# Altium schematic sheet LED.SchDoc
size A1
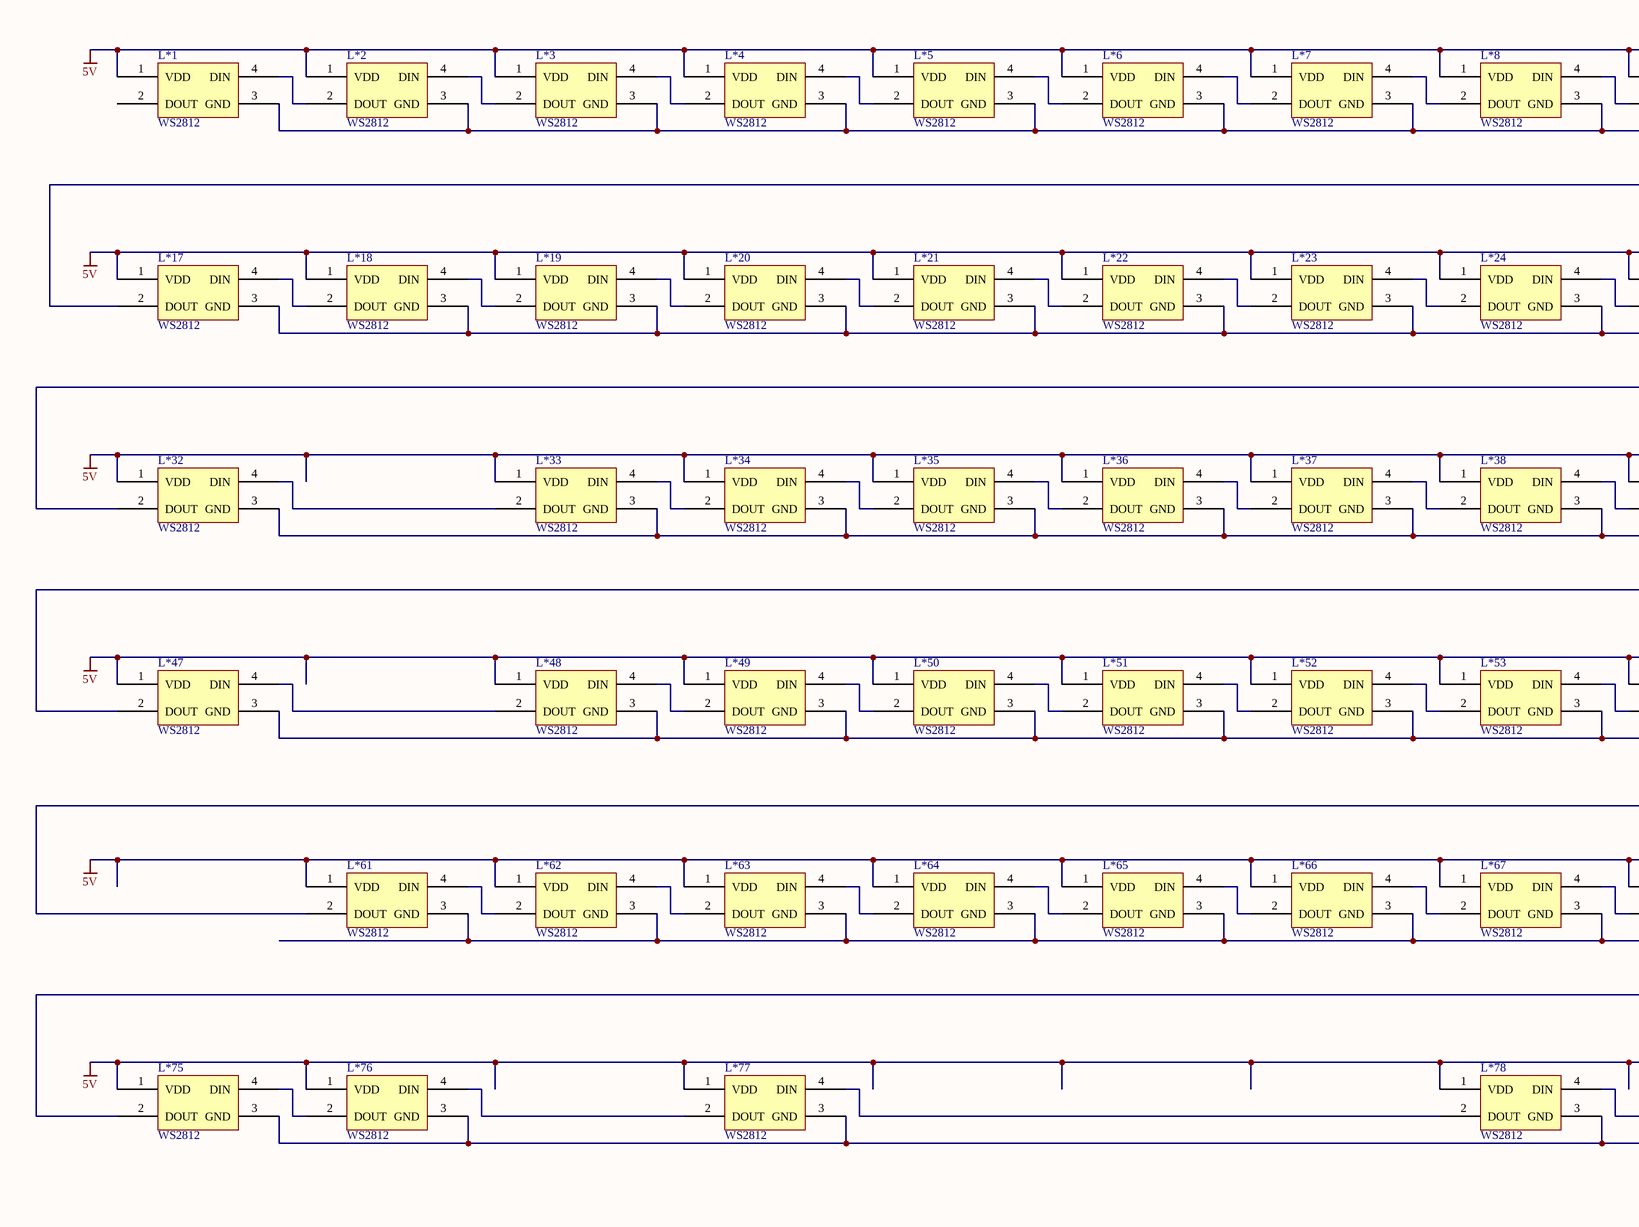
[diagram p0: LED.SchDoc, left]
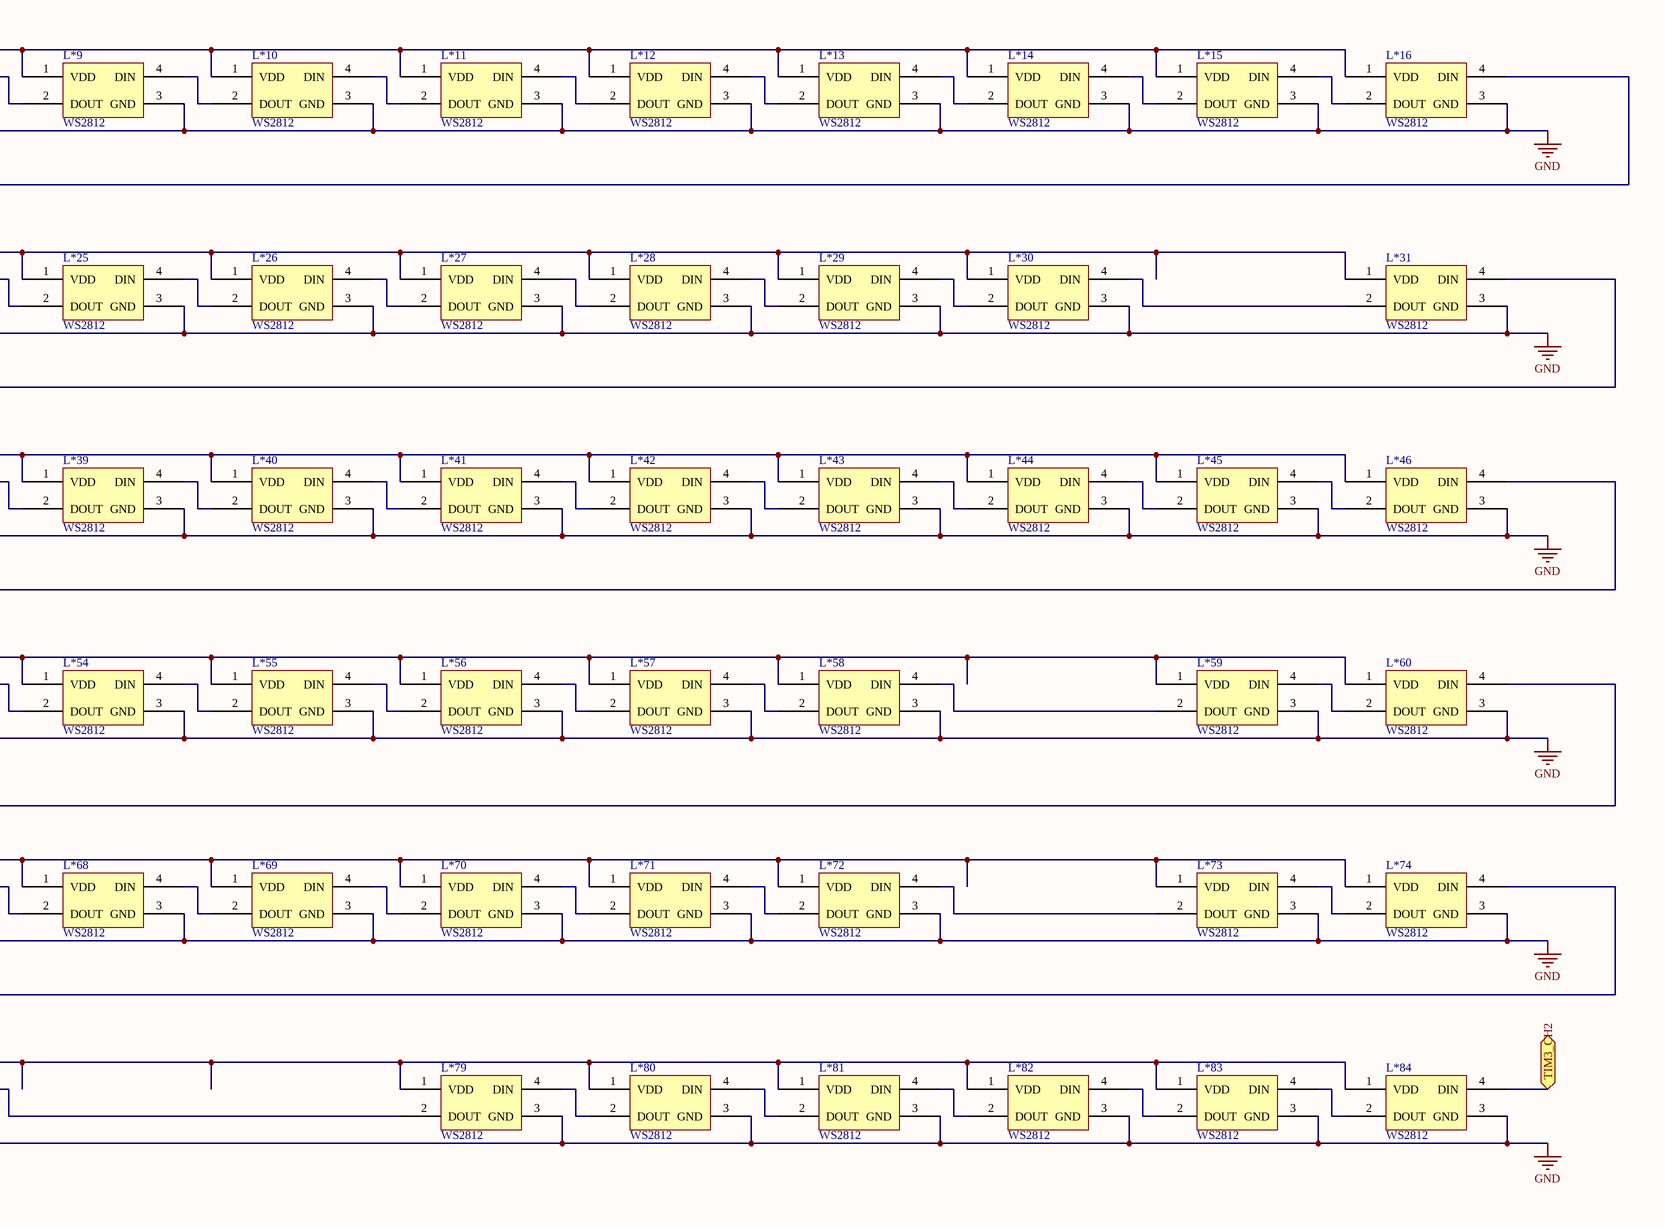
[diagram p1: LED.SchDoc, right]

## Parts
L*1  WS2812  [3528-4反贴]
L*2  WS2812  [3528-4反贴]
L*3  WS2812  [3528-4反贴]
L*4  WS2812  [3528-4反贴]
L*5  WS2812  [3528-4反贴]
L*6  WS2812  [3528-4反贴]
L*7  WS2812  [3528-4反贴]
L*8  WS2812  [3528-4反贴]
L*9  WS2812  [3528-4反贴]
L*10  WS2812  [3528-4反贴]
L*11  WS2812  [3528-4反贴]
L*12  WS2812  [3528-4反贴]
L*13  WS2812  [3528-4反贴]
L*14  WS2812  [3528-4反贴]
L*15  WS2812  [3528-4反贴]
L*16  WS2812  [3528-4反贴]
L*17  WS2812  [3528-4反贴]
L*18  WS2812  [3528-4反贴]
L*19  WS2812  [3528-4反贴]
L*20  WS2812  [3528-4反贴]
L*21  WS2812  [3528-4反贴]
L*22  WS2812  [3528-4反贴]
L*23  WS2812  [3528-4反贴]
L*24  WS2812  [3528-4反贴]
L*25  WS2812  [3528-4反贴]
L*26  WS2812  [3528-4反贴]
L*27  WS2812  [3528-4反贴]
L*28  WS2812  [3528-4反贴]
L*29  WS2812  [3528-4反贴]
L*30  WS2812  [3528-4反贴]
L*31  WS2812  [3528-4反贴]
L*32  WS2812  [3528-4反贴]
L*33  WS2812  [3528-4反贴]
L*34  WS2812  [3528-4反贴]
L*35  WS2812  [3528-4反贴]
L*36  WS2812  [3528-4反贴]
L*37  WS2812  [3528-4反贴]
L*38  WS2812  [3528-4反贴]
L*39  WS2812  [3528-4反贴]
L*40  WS2812  [3528-4反贴]
L*41  WS2812  [3528-4反贴]
L*42  WS2812  [3528-4反贴]
L*43  WS2812  [3528-4反贴]
L*44  WS2812  [3528-4反贴]
L*45  WS2812  [3528-4反贴]
L*46  WS2812  [3528-4反贴]
L*47  WS2812  [3528-4反贴]
L*48  WS2812  [3528-4反贴]
L*49  WS2812  [3528-4反贴]
L*50  WS2812  [3528-4反贴]
L*51  WS2812  [3528-4反贴]
L*52  WS2812  [3528-4反贴]
L*53  WS2812  [3528-4反贴]
L*54  WS2812  [3528-4反贴]
L*55  WS2812  [3528-4反贴]
L*56  WS2812  [3528-4反贴]
L*57  WS2812  [3528-4反贴]
L*58  WS2812  [3528-4反贴]
L*59  WS2812  [3528-4反贴]
L*60  WS2812  [3528-4反贴]
L*61  WS2812  [3528-4反贴]
L*62  WS2812  [3528-4反贴]
L*63  WS2812  [3528-4反贴]
L*64  WS2812  [3528-4反贴]
L*65  WS2812  [3528-4反贴]
L*66  WS2812  [3528-4反贴]
L*67  WS2812  [3528-4反贴]
L*68  WS2812  [3528-4反贴]
L*69  WS2812  [3528-4反贴]
L*70  WS2812  [3528-4反贴]
L*71  WS2812  [3528-4反贴]
L*72  WS2812  [3528-4反贴]
L*73  WS2812  [3528-4反贴]
L*74  WS2812  [3528-4反贴]
L*75  WS2812  [3528-4反贴]
L*76  WS2812  [3528-4反贴]
L*77  WS2812  [3528-4反贴]
L*78  WS2812  [3528-4反贴]
L*79  WS2812  [3528-4反贴]
L*80  WS2812  [3528-4反贴]
L*81  WS2812  [3528-4反贴]
L*82  WS2812  [3528-4反贴]
L*83  WS2812  [3528-4反贴]
L*84  WS2812  [3528-4反贴]

## Ports
TIM3_CH2 (bidir)

## Nets
5V: L*1.1(VDD) L*2.1(VDD) L*3.1(VDD) L*4.1(VDD) L*5.1(VDD) L*6.1(VDD) L*7.1(VDD) L*8.1(VDD) L*9.1(VDD) L*10.1(VDD) L*11.1(VDD) L*12.1(VDD) L*13.1(VDD) L*14.1(VDD) L*15.1(VDD) L*16.1(VDD) L*17.1(VDD) L*18.1(VDD) L*19.1(VDD) L*20.1(VDD) L*21.1(VDD) L*22.1(VDD) L*23.1(VDD) L*24.1(VDD) L*25.1(VDD) L*26.1(VDD) L*27.1(VDD) L*28.1(VDD) L*29.1(VDD) L*30.1(VDD) L*31.1(VDD) L*32.1(VDD) L*33.1(VDD) L*34.1(VDD) L*35.1(VDD) L*36.1(VDD) L*37.1(VDD) L*38.1(VDD) L*39.1(VDD) L*40.1(VDD) L*41.1(VDD) L*42.1(VDD) L*43.1(VDD) L*44.1(VDD) L*45.1(VDD) L*46.1(VDD) L*47.1(VDD) L*48.1(VDD) L*49.1(VDD) L*50.1(VDD) L*51.1(VDD) L*52.1(VDD) L*53.1(VDD) L*54.1(VDD) L*55.1(VDD) L*56.1(VDD) L*57.1(VDD) L*58.1(VDD) L*59.1(VDD) L*60.1(VDD) L*61.1(VDD) L*62.1(VDD) L*63.1(VDD) L*64.1(VDD) L*65.1(VDD) L*66.1(VDD) L*67.1(VDD) L*68.1(VDD) L*69.1(VDD) L*70.1(VDD) L*71.1(VDD) L*72.1(VDD) L*73.1(VDD) L*74.1(VDD) L*75.1(VDD) L*76.1(VDD) L*77.1(VDD) L*78.1(VDD) L*79.1(VDD) L*80.1(VDD) L*81.1(VDD) L*82.1(VDD) L*83.1(VDD) L*84.1(VDD)
GND: L*1.3(GND) L*2.3(GND) L*3.3(GND) L*4.3(GND) L*5.3(GND) L*6.3(GND) L*7.3(GND) L*8.3(GND) L*9.3(GND) L*10.3(GND) L*11.3(GND) L*12.3(GND) L*13.3(GND) L*14.3(GND) L*15.3(GND) L*16.3(GND) L*17.3(GND) L*18.3(GND) L*19.3(GND) L*20.3(GND) L*21.3(GND) L*22.3(GND) L*23.3(GND) L*24.3(GND) L*25.3(GND) L*26.3(GND) L*27.3(GND) L*28.3(GND) L*29.3(GND) L*30.3(GND) L*31.3(GND) L*32.3(GND) L*33.3(GND) L*34.3(GND) L*35.3(GND) L*36.3(GND) L*37.3(GND) L*38.3(GND) L*39.3(GND) L*40.3(GND) L*41.3(GND) L*42.3(GND) L*43.3(GND) L*44.3(GND) L*45.3(GND) L*46.3(GND) L*47.3(GND) L*48.3(GND) L*49.3(GND) L*50.3(GND) L*51.3(GND) L*52.3(GND) L*53.3(GND) L*54.3(GND) L*55.3(GND) L*56.3(GND) L*57.3(GND) L*58.3(GND) L*59.3(GND) L*60.3(GND) L*61.3(GND) L*62.3(GND) L*63.3(GND) L*64.3(GND) L*65.3(GND) L*66.3(GND) L*67.3(GND) L*68.3(GND) L*69.3(GND) L*70.3(GND) L*71.3(GND) L*72.3(GND) L*73.3(GND) L*74.3(GND) L*75.3(GND) L*76.3(GND) L*77.3(GND) L*78.3(GND) L*79.3(GND) L*80.3(GND) L*81.3(GND) L*82.3(GND) L*83.3(GND) L*84.3(GND)
TIM3_CH2: L*84.4(DIN) ; port TIM3_CH2
NetL*1_4: L*1.4(DIN) L*2.2(DOUT)
NetL*2_4: L*2.4(DIN) L*3.2(DOUT)
NetL*3_4: L*3.4(DIN) L*4.2(DOUT)
NetL*4_4: L*4.4(DIN) L*5.2(DOUT)
NetL*5_4: L*5.4(DIN) L*6.2(DOUT)
NetL*6_4: L*6.4(DIN) L*7.2(DOUT)
NetL*7_4: L*7.4(DIN) L*8.2(DOUT)
NetL*8_4: L*8.4(DIN) L*9.2(DOUT)
NetL*9_4: L*9.4(DIN) L*10.2(DOUT)
NetL*10_4: L*10.4(DIN) L*11.2(DOUT)
NetL*11_4: L*11.4(DIN) L*12.2(DOUT)
NetL*12_4: L*12.4(DIN) L*13.2(DOUT)
NetL*13_4: L*13.4(DIN) L*14.2(DOUT)
NetL*14_4: L*14.4(DIN) L*15.2(DOUT)
NetL*15_4: L*15.4(DIN) L*16.2(DOUT)
NetL*16_4: L*16.4(DIN) L*17.2(DOUT)
NetL*17_4: L*17.4(DIN) L*18.2(DOUT)
NetL*18_4: L*18.4(DIN) L*19.2(DOUT)
NetL*19_4: L*19.4(DIN) L*20.2(DOUT)
NetL*20_4: L*20.4(DIN) L*21.2(DOUT)
NetL*21_4: L*21.4(DIN) L*22.2(DOUT)
NetL*22_4: L*22.4(DIN) L*23.2(DOUT)
NetL*23_4: L*23.4(DIN) L*24.2(DOUT)
NetL*24_4: L*24.4(DIN) L*25.2(DOUT)
NetL*25_4: L*25.4(DIN) L*26.2(DOUT)
NetL*26_4: L*26.4(DIN) L*27.2(DOUT)
NetL*27_4: L*27.4(DIN) L*28.2(DOUT)
NetL*28_4: L*28.4(DIN) L*29.2(DOUT)
NetL*29_4: L*29.4(DIN) L*30.2(DOUT)
NetL*30_4: L*30.4(DIN) L*31.2(DOUT)
NetL*31_4: L*31.4(DIN) L*32.2(DOUT)
NetL*32_4: L*32.4(DIN) L*33.2(DOUT)
NetL*33_4: L*33.4(DIN) L*34.2(DOUT)
NetL*34_4: L*34.4(DIN) L*35.2(DOUT)
NetL*35_4: L*35.4(DIN) L*36.2(DOUT)
NetL*36_4: L*36.4(DIN) L*37.2(DOUT)
NetL*37_4: L*37.4(DIN) L*38.2(DOUT)
NetL*38_4: L*38.4(DIN) L*39.2(DOUT)
NetL*39_4: L*39.4(DIN) L*40.2(DOUT)
NetL*40_4: L*40.4(DIN) L*41.2(DOUT)
NetL*41_4: L*41.4(DIN) L*42.2(DOUT)
NetL*42_4: L*42.4(DIN) L*43.2(DOUT)
NetL*43_4: L*43.4(DIN) L*44.2(DOUT)
NetL*44_4: L*44.4(DIN) L*45.2(DOUT)
NetL*45_4: L*45.4(DIN) L*46.2(DOUT)
NetL*46_4: L*46.4(DIN) L*47.2(DOUT)
NetL*47_4: L*47.4(DIN) L*48.2(DOUT)
NetL*48_4: L*48.4(DIN) L*49.2(DOUT)
NetL*49_4: L*49.4(DIN) L*50.2(DOUT)
NetL*50_4: L*50.4(DIN) L*51.2(DOUT)
NetL*51_4: L*51.4(DIN) L*52.2(DOUT)
NetL*52_4: L*52.4(DIN) L*53.2(DOUT)
NetL*53_4: L*53.4(DIN) L*54.2(DOUT)
NetL*54_4: L*54.4(DIN) L*55.2(DOUT)
NetL*55_4: L*55.4(DIN) L*56.2(DOUT)
NetL*56_4: L*56.4(DIN) L*57.2(DOUT)
NetL*57_4: L*57.4(DIN) L*58.2(DOUT)
NetL*58_4: L*58.4(DIN) L*59.2(DOUT)
NetL*59_4: L*59.4(DIN) L*60.2(DOUT)
NetL*60_4: L*60.4(DIN) L*61.2(DOUT)
NetL*61_4: L*61.4(DIN) L*62.2(DOUT)
NetL*62_4: L*62.4(DIN) L*63.2(DOUT)
NetL*63_4: L*63.4(DIN) L*64.2(DOUT)
NetL*64_4: L*64.4(DIN) L*65.2(DOUT)
NetL*65_4: L*65.4(DIN) L*66.2(DOUT)
NetL*66_4: L*66.4(DIN) L*67.2(DOUT)
NetL*67_4: L*67.4(DIN) L*68.2(DOUT)
NetL*68_4: L*68.4(DIN) L*69.2(DOUT)
NetL*69_4: L*69.4(DIN) L*70.2(DOUT)
NetL*70_4: L*70.4(DIN) L*71.2(DOUT)
NetL*71_4: L*71.4(DIN) L*72.2(DOUT)
NetL*72_4: L*72.4(DIN) L*73.2(DOUT)
NetL*73_4: L*73.4(DIN) L*74.2(DOUT)
NetL*74_4: L*74.4(DIN) L*75.2(DOUT)
NetL*75_4: L*75.4(DIN) L*76.2(DOUT)
NetL*76_4: L*76.4(DIN) L*77.2(DOUT)
NetL*77_4: L*77.4(DIN) L*78.2(DOUT)
NetL*78_4: L*78.4(DIN) L*79.2(DOUT)
NetL*79_4: L*79.4(DIN) L*80.2(DOUT)
NetL*80_4: L*80.4(DIN) L*81.2(DOUT)
NetL*81_4: L*81.4(DIN) L*82.2(DOUT)
NetL*82_4: L*82.4(DIN) L*83.2(DOUT)
NetL*83_4: L*83.4(DIN) L*84.2(DOUT)

Not connected (* = marked no-connect by the designer): L*1 2(DOUT)

## Notes on the sheet
- Title
- Size:
- Date:
- File:
- A1
- Number:
- Time:
- Revision:
- Sheet
- of